# EAGLE design Limero-ESP01 (EAGLE 7.3.0)
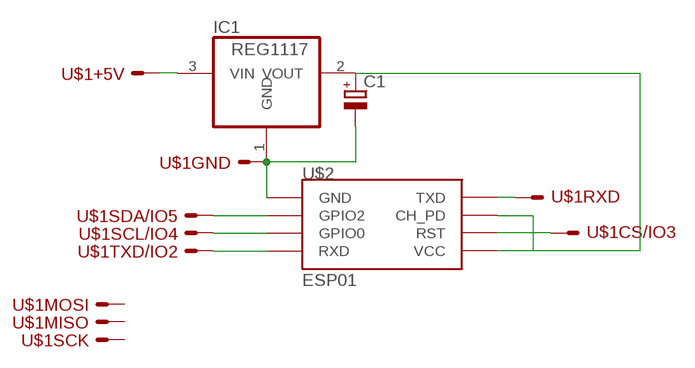
[diagram p0: schematic, sheet 1]

## Parts
C1  CPOL-EUB45181A  [B45181A]
IC1  REG1117  [SOT223]
U$1  LIMERO_BUS  [SPI_BUS]
U$2  ESP01  [ESP01]

## Nets
N$1: C1.- IC1.1(GND) U$1.GND U$2.GND
N$2: U$1.TXD U$2.RX(RXD)
N$3: U$1.RXD U$2.TX(TXD)
N$4: U$1.CS U$2.RST
N$5: U$1.SCL U$2.GPIO0
N$6: U$1.SDA U$2.GPIO2
N$8: IC1.3(VIN) U$1.+5V
N$9: C1.+ IC1.2(VOUT) U$2.CH_PD U$2.VCC
Unconnected: U$1.MISO U$1.MOSI U$1.SCK

## Library data of the parts
C1 = resistor:CPOL-EU: POLARIZED CAPACITOR, European symbol
IC1 = burr-brown:REG1117: 800mA and 1A Low Dropout (LDO) Positive Regulator 1.8V, 2.5V, 2.85V, 3.3V, 5V, and Adj; MPN: REG1117; OC_FARNELL: 1097566; OC_NEWARK: 14P6981
U$1 = lieven:LIMERO_BUS
U$2 = esp8266modules:ESP01: ESP8266 Wifi module 01

## Board
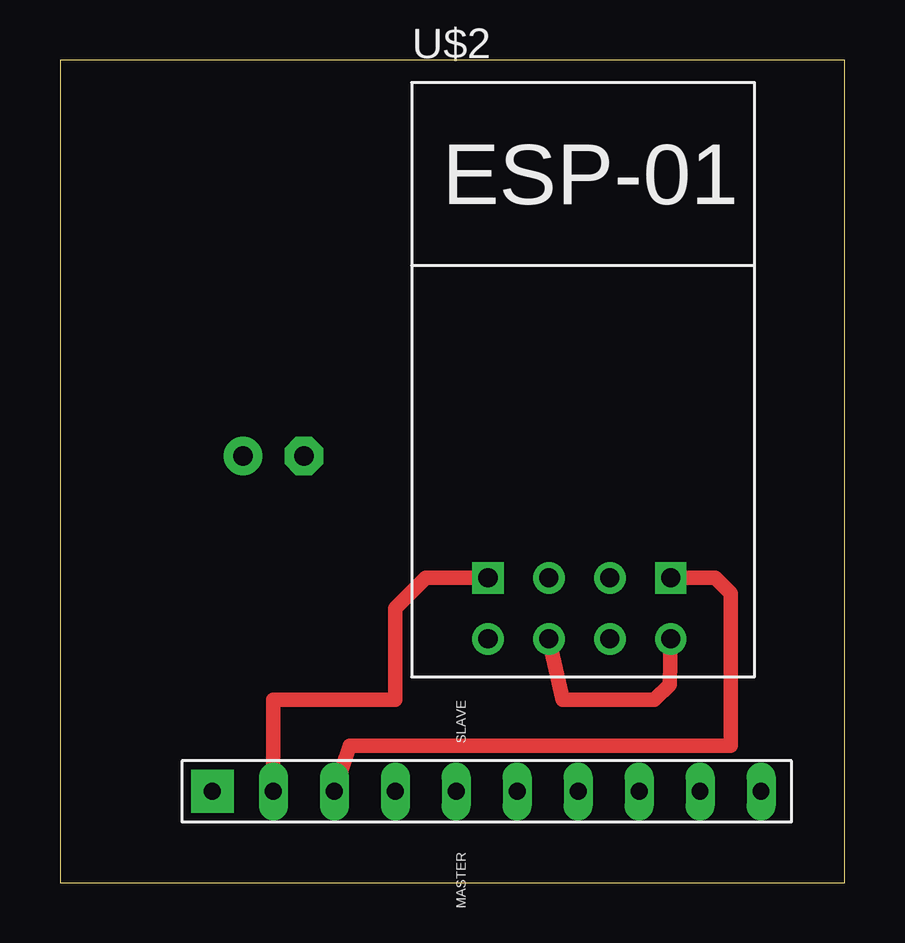
[diagram p1: board, top side]
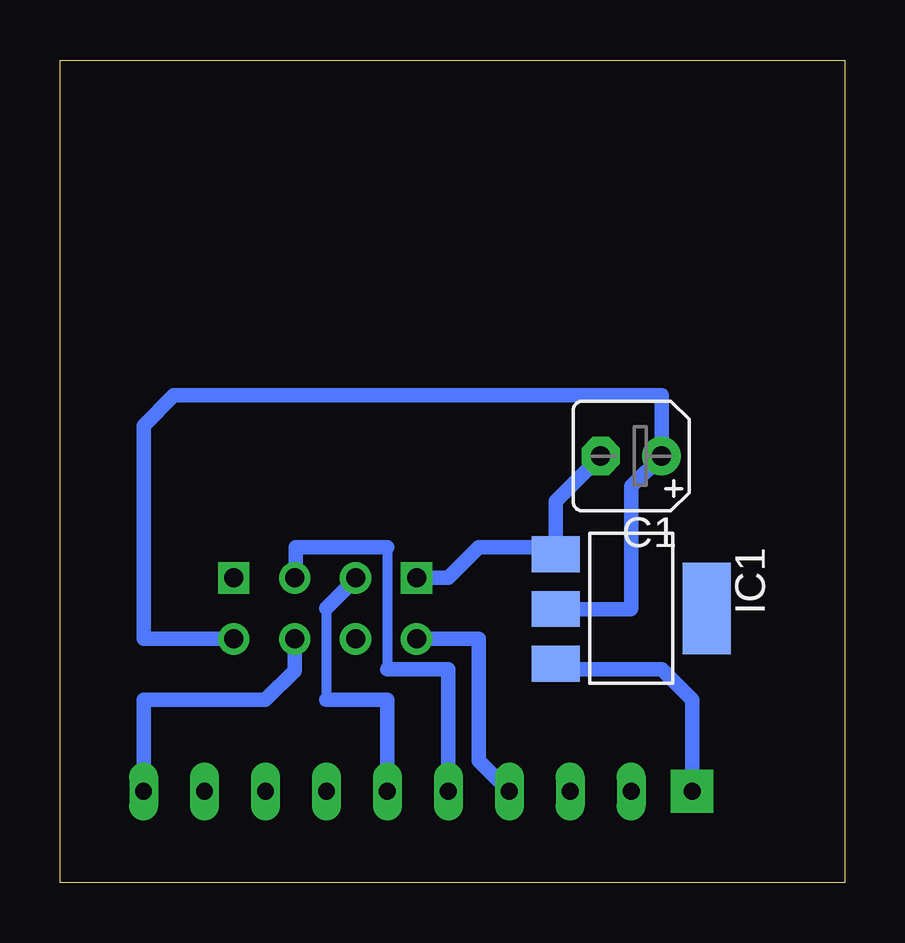
[diagram p2: board, bottom side, seen from below]

Size 32.69 x 34.28 mm. Coordinates in mm from the lower left corner, seen from the top.
Outline: 0,0 32.69,0 32.69,34.28 0,34.28 0,0
Copper layers (1*16): Top 0.035mm / dielectric 1.5mm / Bottom 0.035mm
Design rules "default": minimum track width 10mil, minimum drill 24mil, track to track 8mil, track to pad 8mil, pad to pad 8mil, via to via 8mil, smd to smd 8mil, copper to edge 40mil, drill to drill 8mil, minimum pad ring 10mil, minimum via ring 8mil, stop-mask expansion 4mil, vias tented up to drill 0mil, thermal gap 10mil

### Footprints (pad centres in the part's own frame; a part is rotated, then mirrored left to right if it is on the bottom)
B45181A = drill 0.813 pad 1.6: + -1.27,0 | drill 0.813 pad 1.6 octagon: - 1.27,0
SOT223 = smd 1.499 x 2.007: 1 -2.261,-3.15; 2 0.025,-3.15; 3 2.311,-3.15 | smd 3.81 x 2.007: 4 0,3.15
SPI_BUS = drill 0.7 pad 1.778 square: +5V 0,0 | drill 0.7 long: CS 0,22.86; GND 0,2.54; MISO 0,15.24; MOSI 0,17.78; RXD 0,7.62; SCK 0,20.32; SCL 0,10.16; SDA 0,12.7; TXD 0,5.08
ESP01 = drill 0.8: CH_PD 2.59,0.001; GPIO0 5.13,2.541; GPIO2 2.59,2.541; RST 5.13,0.001; TX 0.05,0.001; VCC 7.67,0.001 | drill 0.8 square: GND 0.05,2.541; RX 7.67,2.541

### Placement (x,y rotation side)
C1  8.89,17.78 180 bottom
IC1  8.89,11.43 270 bottom
U$1  6.35,3.81 270 top
U$2  17.78,10.16 0 top

### Tracks (layer width: path | path; a pad name or v marks a point on that pad's centre or on a via)
N$1
  Top 0.61: U$1.GND 8.89,7.62 13.97,7.62 13.97,11.43 15.24,12.7 U$2.GND
  Bottom 0.61: C1.- 12.04,15.9 IC1.1 12.32,13.97 15.24,13.97 16.51,12.7 U$2.GND
N$2
  Top 0.61: U$1.TXD 12.06,5.71 27.94,5.71 27.94,12.06 27.3,12.7 26.04,12.7 U$2.RX
N$3
  Bottom 0.406: U$2.TX 17.78,10.16
  Bottom 0.61: 17.78,10.16 16.51,10.16 15.24,10.16 15.24,5.08 U$1.RXD
N$4
  Bottom 0.61: U$2.RST 22.91,8.84 24.13,7.62 29.21,7.62 U$1.CS
N$5
  Bottom 0.406: U$2.GPIO0 22.86,12.7 | 22.86,13.97 | 19.05,13.97 19.05,8.89
  Bottom 0.61: 22.86,12.7 22.86,13.97 | 22.86,13.97 19.05,13.97 | 19.05,8.89 16.51,8.89 U$1.SCL
N$6
  Bottom 0.406: U$2.GPIO2 20.32,12.7 | 21.59,11.43 21.59,7.62
  Bottom 0.61: 20.32,12.7 21.59,11.43 | 21.59,7.62 19.05,7.62 U$1.SDA
N$8
  Bottom 0.406: 11.81,8.89 IC1.3
  Bottom 0.61: U$1.+5V 6.35,7.62 7.62,8.89 11.81,8.89
N$9
  Top 0.61: U$2.CH_PD 20.95,7.62 24.77,7.62 25.4,8.26 U$2.VCC
  Bottom 0.406: 29.21,10.16
  Bottom 0.61: IC1.2 8.91,11.4 8.89,11.43 8.89,16.51 C1.+ 7.62,20.32 27.94,20.32 29.21,19.05 29.21,10.16 | U$2.VCC 29.21,10.16